# Altium schematic sheet B13.SchDoc: ZoM Mod A - FPGA Bank 13
size A4; Organization: Trenz Electronic GmbH / TT; DocumentNumber: 6; Revision: 01; SheetNumber: 6; SheetTotal: 13; Date: 12/16/2014
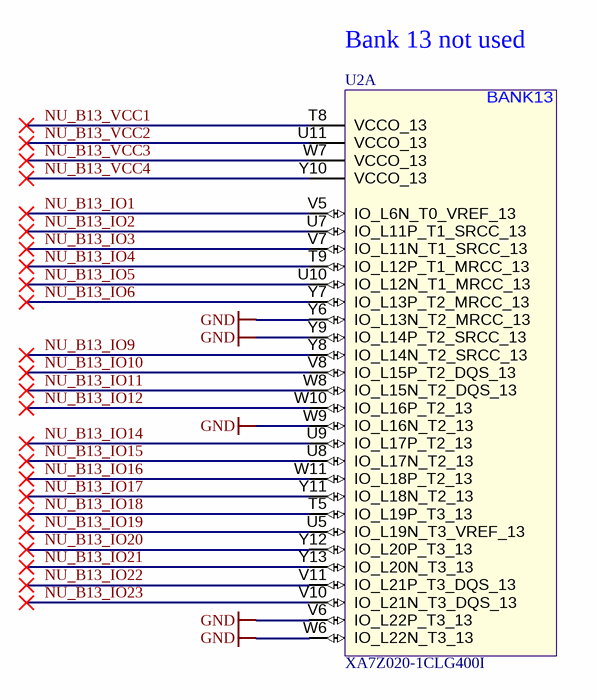
[diagram p0: B13.SchDoc]

## Parts
U2  XA7Z020-1CLG400I  [BGA400C80P20X20_1700X1700X160N]  (part A of 8)

## Nets
GND: U2.V6(IO_L22P_T3_13) U2.W6(IO_L22N_T3_13) U2.W9(IO_L16N_T2_13) U2.Y6(IO_L13N_T2_MRCC_13) U2.Y9(IO_L14P_T2_SRCC_13)
NU_B13_IO1: U2.V5(IO_L6N_T0_VREF_13)
NU_B13_IO2: U2.U7(IO_L11P_T1_SRCC_13)
NU_B13_IO3: U2.V7(IO_L11N_T1_SRCC_13)
NU_B13_IO4: U2.T9(IO_L12P_T1_MRCC_13)
NU_B13_IO5: U2.U10(IO_L12N_T1_MRCC_13)
NU_B13_IO6: U2.Y7(IO_L13P_T2_MRCC_13)
NU_B13_IO9: U2.Y8(IO_L14N_T2_SRCC_13)
NU_B13_IO10: U2.V8(IO_L15P_T2_DQS_13)
NU_B13_IO11: U2.W8(IO_L15N_T2_DQS_13)
NU_B13_IO12: U2.W10(IO_L16P_T2_13)
NU_B13_IO14: U2.U9(IO_L17P_T2_13)
NU_B13_IO15: U2.U8(IO_L17N_T2_13)
NU_B13_IO16: U2.W11(IO_L18P_T2_13)
NU_B13_IO17: U2.Y11(IO_L18N_T2_13)
NU_B13_IO18: U2.T5(IO_L19P_T3_13)
NU_B13_IO19: U2.U5(IO_L19N_T3_VREF_13)
NU_B13_IO20: U2.Y12(IO_L20P_T3_13)
NU_B13_IO21: U2.Y13(IO_L20N_T3_13)
NU_B13_IO22: U2.V11(IO_L21P_T3_DQS_13)
NU_B13_IO23: U2.V10(IO_L21N_T3_DQS_13)
NU_B13_VCC1: U2.T8(VCCO_13)
NU_B13_VCC2: U2.U11(VCCO_13)
NU_B13_VCC3: U2.W7(VCCO_13)
NU_B13_VCC4: U2.Y10(VCCO_13)

## Notes on the sheet
- Bank 13 not used
- Title:
- Nummer:
- Rev.
- Datum:
- A4
- Zeichner:
- Blatt
- von
- Filename:
- (in symbol 25981, part A) BANK13

## Library data of the parts
U2 = 25981: AN: 25981; Mixed: SMT; Trenz-Stock: Yes; Case: CLG400; HelpURL: B:\AD\adlib\datasheet\XC7